# EAGLE schematic vr60 (EAGLE 9.5.1)

## Sheet 1 of 2
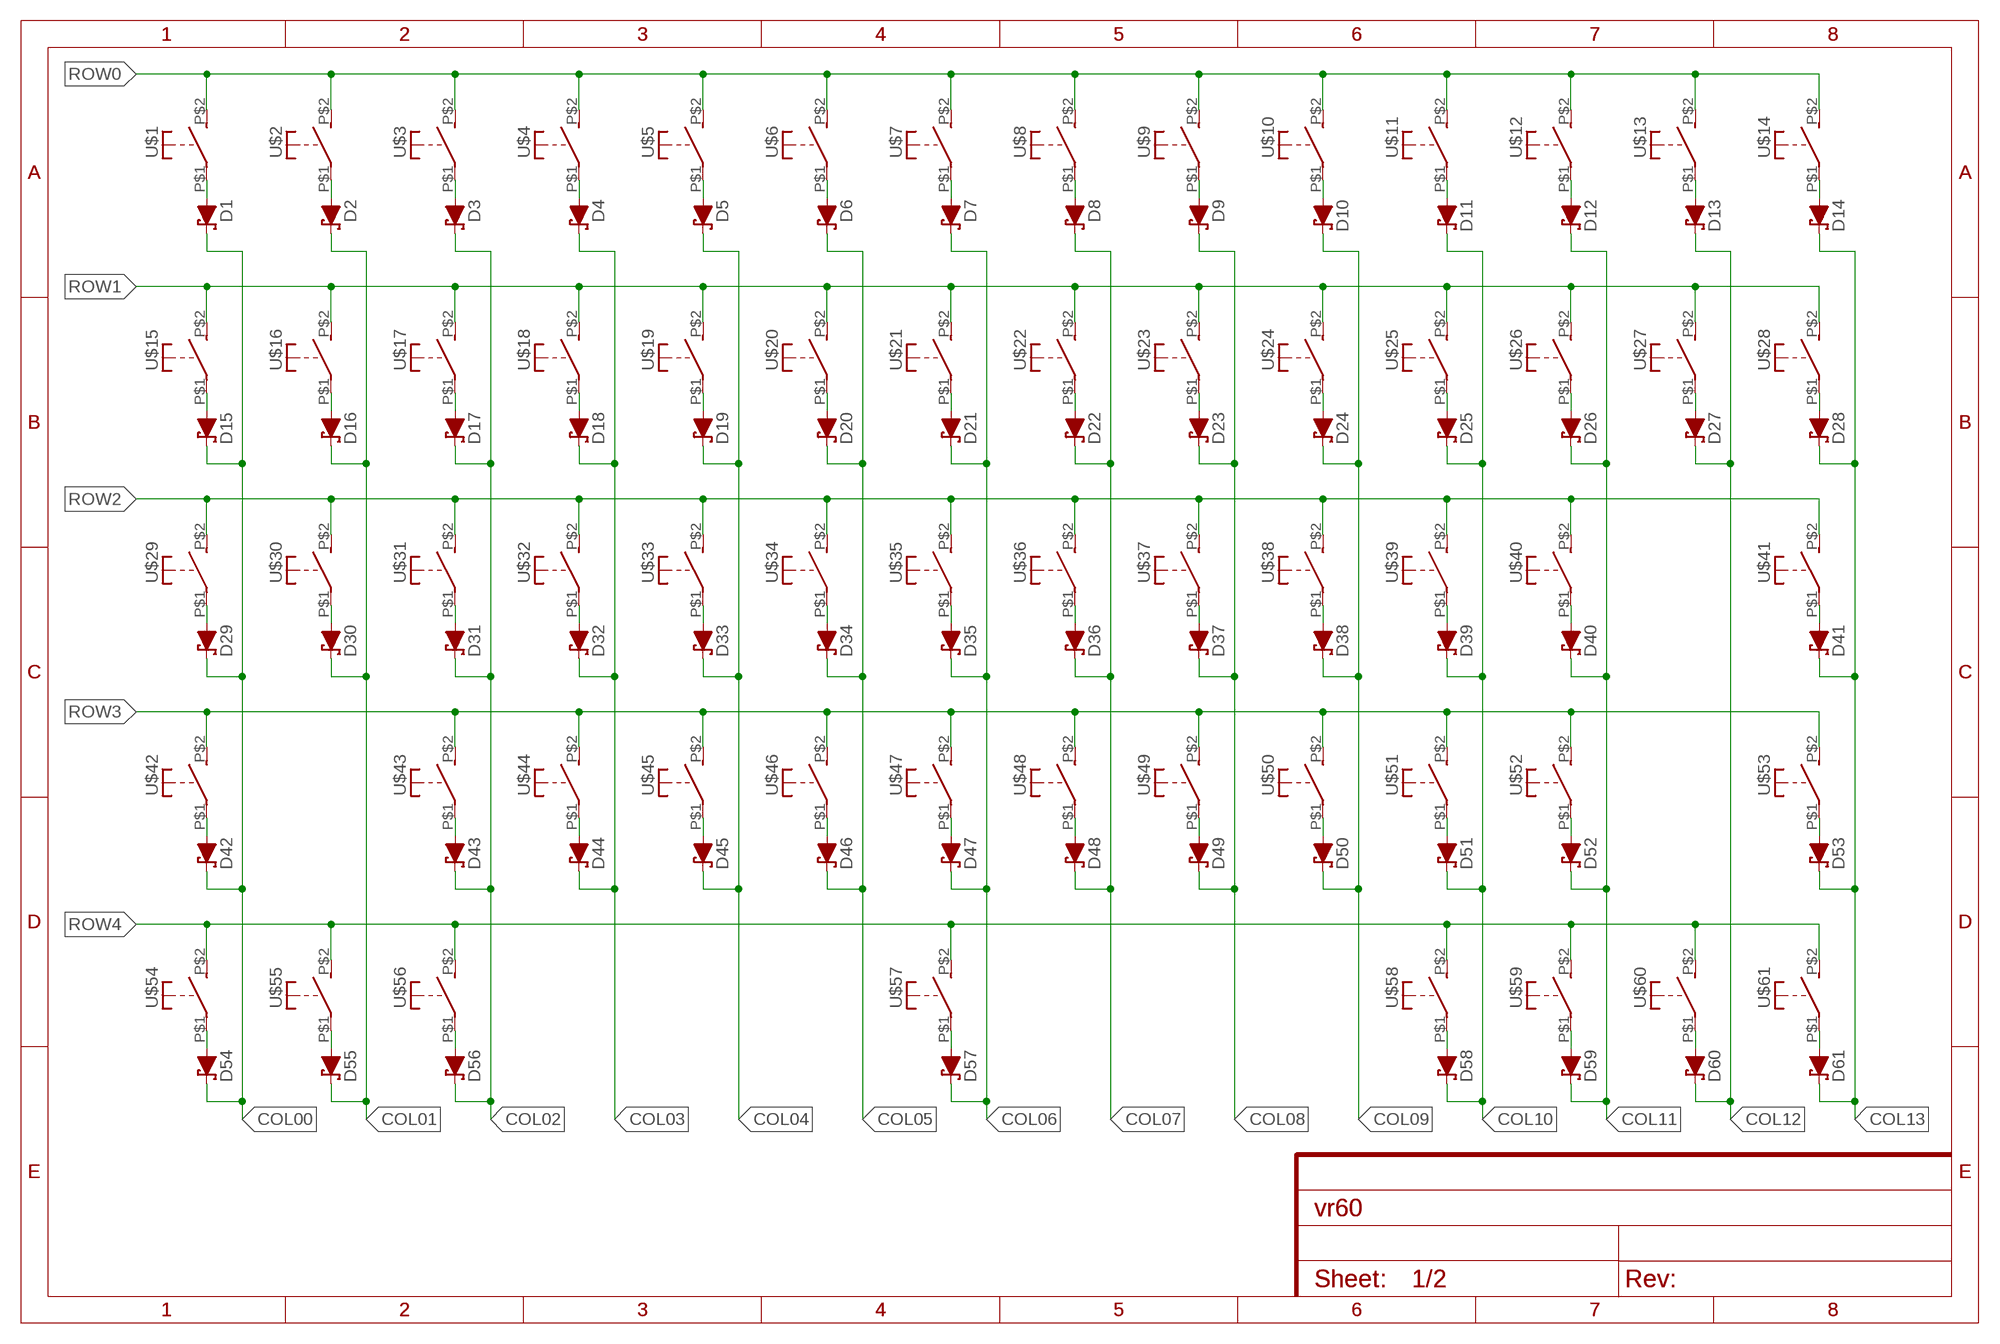
[diagram p0: schematic, sheet 1]

### Parts
D1  1N5819WS  [SOD-123]
D2  1N5819WS  [SOD-123]
D3  1N5819WS  [SOD-123]
D4  1N5819WS  [SOD-123]
D5  1N5819WS  [SOD-123]
D6  1N5819WS  [SOD-123]
D7  1N5819WS  [SOD-123]
D8  1N5819WS  [SOD-123]
D9  1N5819WS  [SOD-123]
D10  1N5819WS  [SOD-123]
D11  1N5819WS  [SOD-123]
D12  1N5819WS  [SOD-123]
D13  1N5819WS  [SOD-123]
D14  1N5819WS  [SOD-123]
D15  1N5819WS  [SOD-123]
D16  1N5819WS  [SOD-123]
D17  1N5819WS  [SOD-123]
D18  1N5819WS  [SOD-123]
D19  1N5819WS  [SOD-123]
D20  1N5819WS  [SOD-123]
D21  1N5819WS  [SOD-123]
D22  1N5819WS  [SOD-123]
D23  1N5819WS  [SOD-123]
D24  1N5819WS  [SOD-123]
D25  1N5819WS  [SOD-123]
D26  1N5819WS  [SOD-123]
D27  1N5819WS  [SOD-123]
D28  1N5819WS  [SOD-123]
D29  1N5819WS  [SOD-123]
D30  1N5819WS  [SOD-123]
D31  1N5819WS  [SOD-123]
D32  1N5819WS  [SOD-123]
D33  1N5819WS  [SOD-123]
D34  1N5819WS  [SOD-123]
D35  1N5819WS  [SOD-123]
D36  1N5819WS  [SOD-123]
D37  1N5819WS  [SOD-123]
D38  1N5819WS  [SOD-123]
D39  1N5819WS  [SOD-123]
D40  1N5819WS  [SOD-123]
D41  1N5819WS  [SOD-123]
D42  1N5819WS  [SOD-123]
D43  1N5819WS  [SOD-123]
D44  1N5819WS  [SOD-123]
D45  1N5819WS  [SOD-123]
D46  1N5819WS  [SOD-123]
D47  1N5819WS  [SOD-123]
D48  1N5819WS  [SOD-123]
D49  1N5819WS  [SOD-123]
D50  1N5819WS  [SOD-123]
D51  1N5819WS  [SOD-123]
D52  1N5819WS  [SOD-123]
D53  1N5819WS  [SOD-123]
D54  1N5819WS  [SOD-123]
D55  1N5819WS  [SOD-123]
D56  1N5819WS  [SOD-123]
D57  1N5819WS  [SOD-123]
D58  1N5819WS  [SOD-123]
D59  1N5819WS  [SOD-123]
D60  1N5819WS  [SOD-123]
D61  1N5819WS  [SOD-123]
U$1  MX-5-PIN-HOTSWAP  [MX-5-PIN-HOTSWAP]
U$2  MX-5-PIN-HOTSWAP  [MX-5-PIN-HOTSWAP]
U$3  MX-5-PIN-HOTSWAP  [MX-5-PIN-HOTSWAP]
U$4  MX-5-PIN-HOTSWAP  [MX-5-PIN-HOTSWAP]
U$5  MX-5-PIN-HOTSWAP  [MX-5-PIN-HOTSWAP]
U$6  MX-5-PIN-HOTSWAP  [MX-5-PIN-HOTSWAP]
U$7  MX-5-PIN-HOTSWAP  [MX-5-PIN-HOTSWAP]
U$8  MX-5-PIN-HOTSWAP  [MX-5-PIN-HOTSWAP]
U$9  MX-5-PIN-HOTSWAP  [MX-5-PIN-HOTSWAP]
U$10  MX-5-PIN-HOTSWAP  [MX-5-PIN-HOTSWAP]
U$11  MX-5-PIN-HOTSWAP  [MX-5-PIN-HOTSWAP]
U$12  MX-5-PIN-HOTSWAP  [MX-5-PIN-HOTSWAP]
U$13  MX-5-PIN-HOTSWAP  [MX-5-PIN-HOTSWAP]
U$14  MX-5-PIN-HOTSWAP  [MX-5-PIN-HOTSWAP]
U$15  MX-5-PIN-HOTSWAP  [MX-5-PIN-HOTSWAP]
U$16  MX-5-PIN-HOTSWAP  [MX-5-PIN-HOTSWAP]
U$17  MX-5-PIN-HOTSWAP  [MX-5-PIN-HOTSWAP]
U$18  MX-5-PIN-HOTSWAP  [MX-5-PIN-HOTSWAP]
U$19  MX-5-PIN-HOTSWAP  [MX-5-PIN-HOTSWAP]
U$20  MX-5-PIN-HOTSWAP  [MX-5-PIN-HOTSWAP]
U$21  MX-5-PIN-HOTSWAP  [MX-5-PIN-HOTSWAP]
U$22  MX-5-PIN-HOTSWAP  [MX-5-PIN-HOTSWAP]
U$23  MX-5-PIN-HOTSWAP  [MX-5-PIN-HOTSWAP]
U$24  MX-5-PIN-HOTSWAP  [MX-5-PIN-HOTSWAP]
U$25  MX-5-PIN-HOTSWAP  [MX-5-PIN-HOTSWAP]
U$26  MX-5-PIN-HOTSWAP  [MX-5-PIN-HOTSWAP]
U$27  MX-5-PIN-HOTSWAP  [MX-5-PIN-HOTSWAP]
U$28  MX-5-PIN-HOTSWAP  [MX-5-PIN-HOTSWAP]
U$29  MX-5-PIN-HOTSWAP  [MX-5-PIN-HOTSWAP]
U$30  MX-5-PIN-HOTSWAP  [MX-5-PIN-HOTSWAP]
U$31  MX-5-PIN-HOTSWAP  [MX-5-PIN-HOTSWAP]
U$32  MX-5-PIN-HOTSWAP  [MX-5-PIN-HOTSWAP]
U$33  MX-5-PIN-HOTSWAP  [MX-5-PIN-HOTSWAP]
U$34  MX-5-PIN-HOTSWAP  [MX-5-PIN-HOTSWAP]
U$35  MX-5-PIN-HOTSWAP  [MX-5-PIN-HOTSWAP]
U$36  MX-5-PIN-HOTSWAP  [MX-5-PIN-HOTSWAP]
U$37  MX-5-PIN-HOTSWAP  [MX-5-PIN-HOTSWAP]
U$38  MX-5-PIN-HOTSWAP  [MX-5-PIN-HOTSWAP]
U$39  MX-5-PIN-HOTSWAP  [MX-5-PIN-HOTSWAP]
U$40  MX-5-PIN-HOTSWAP  [MX-5-PIN-HOTSWAP]
U$41  MX-5-PIN-HOTSWAP  [MX-5-PIN-HOTSWAP]
U$42  MX-5-PIN-HOTSWAP  [MX-5-PIN-HOTSWAP]
U$43  MX-5-PIN-HOTSWAP  [MX-5-PIN-HOTSWAP]
U$44  MX-5-PIN-HOTSWAP  [MX-5-PIN-HOTSWAP]
U$45  MX-5-PIN-HOTSWAP  [MX-5-PIN-HOTSWAP]
U$46  MX-5-PIN-HOTSWAP  [MX-5-PIN-HOTSWAP]
U$47  MX-5-PIN-HOTSWAP  [MX-5-PIN-HOTSWAP]
U$48  MX-5-PIN-HOTSWAP  [MX-5-PIN-HOTSWAP]
U$49  MX-5-PIN-HOTSWAP  [MX-5-PIN-HOTSWAP]
U$50  MX-5-PIN-HOTSWAP  [MX-5-PIN-HOTSWAP]
U$51  MX-5-PIN-HOTSWAP  [MX-5-PIN-HOTSWAP]
U$52  MX-5-PIN-HOTSWAP  [MX-5-PIN-HOTSWAP]
U$53  MX-5-PIN-HOTSWAP  [MX-5-PIN-HOTSWAP]
U$54  MX-5-PIN-HOTSWAP  [MX-5-PIN-HOTSWAP]
U$55  MX-5-PIN-HOTSWAP  [MX-5-PIN-HOTSWAP]
U$56  MX-5-PIN-HOTSWAP  [MX-5-PIN-HOTSWAP]
U$57  MX-5-PIN-HOTSWAP  [MX-5-PIN-HOTSWAP]
U$58  MX-5-PIN-HOTSWAP  [MX-5-PIN-HOTSWAP]
U$59  MX-5-PIN-HOTSWAP  [MX-5-PIN-HOTSWAP]
U$60  MX-5-PIN-HOTSWAP  [MX-5-PIN-HOTSWAP]
U$61  MX-5-PIN-HOTSWAP  [MX-5-PIN-HOTSWAP]

### Nets
COL00: D1.C D15.C D29.C D42.C D54.C
COL01: D2.C D16.C D30.C D55.C
COL02: D3.C D17.C D31.C D43.C D56.C
COL03: D4.C D18.C D32.C D44.C
COL04: D5.C D19.C D33.C D45.C
COL05: D6.C D20.C D34.C D46.C
COL06: D7.C D21.C D35.C D47.C D57.C
COL07: D8.C D22.C D36.C D48.C
COL08: D9.C D23.C D37.C D49.C
COL09: D10.C D24.C D38.C D50.C
COL10: D11.C D25.C D39.C D51.C D58.C
COL11: D12.C D26.C D40.C D52.C D59.C
COL12: D13.C D27.C D60.C
COL13: D14.C D28.C D41.C D53.C D61.C
N$1: D1.A U$1.P$1(P)
N$2: D2.A U$2.P$1(P)
N$3: D3.A U$3.P$1(P)
N$4: D4.A U$4.P$1(P)
N$5: D5.A U$5.P$1(P)
N$6: D6.A U$6.P$1(P)
N$7: D7.A U$7.P$1(P)
N$8: D8.A U$8.P$1(P)
N$9: D9.A U$9.P$1(P)
N$10: D10.A U$10.P$1(P)
N$11: D11.A U$11.P$1(P)
N$12: D12.A U$12.P$1(P)
N$13: D13.A U$13.P$1(P)
N$14: D14.A U$14.P$1(P)
N$15: D15.A U$15.P$1(P)
N$16: D16.A U$16.P$1(P)
N$17: D17.A U$17.P$1(P)
N$18: D18.A U$18.P$1(P)
N$19: D19.A U$19.P$1(P)
N$20: D20.A U$20.P$1(P)
N$21: D21.A U$21.P$1(P)
N$22: D22.A U$22.P$1(P)
N$23: D23.A U$23.P$1(P)
N$24: D24.A U$24.P$1(P)
N$25: D25.A U$25.P$1(P)
N$26: D26.A U$26.P$1(P)
N$27: D27.A U$27.P$1(P)
N$28: D28.A U$28.P$1(P)
N$29: D29.A U$29.P$1(P)
N$30: D30.A U$30.P$1(P)
N$31: D31.A U$31.P$1(P)
N$32: D32.A U$32.P$1(P)
N$33: D33.A U$33.P$1(P)
N$34: D34.A U$34.P$1(P)
N$35: D35.A U$35.P$1(P)
N$36: D36.A U$36.P$1(P)
N$37: D37.A U$37.P$1(P)
N$38: D38.A U$38.P$1(P)
N$39: D39.A U$39.P$1(P)
N$40: D40.A U$40.P$1(P)
N$41: D41.A U$41.P$1(P)
N$42: D42.A U$42.P$1(P)
N$43: D43.A U$43.P$1(P)
N$44: D44.A U$44.P$1(P)
N$45: D45.A U$45.P$1(P)
N$46: D46.A U$46.P$1(P)
N$47: D47.A U$47.P$1(P)
N$48: D48.A U$48.P$1(P)
N$49: D49.A U$49.P$1(P)
N$50: D50.A U$50.P$1(P)
N$51: D51.A U$51.P$1(P)
N$52: D52.A U$52.P$1(P)
N$53: D53.A U$53.P$1(P)
N$54: D54.A U$54.P$1(P)
N$55: D55.A U$55.P$1(P)
N$56: D56.A U$56.P$1(P)
N$57: D57.A U$57.P$1(P)
N$58: D58.A U$58.P$1(P)
N$59: D59.A U$59.P$1(P)
N$60: D60.A U$60.P$1(P)
N$61: D61.A U$61.P$1(P)
ROW0: U$1.P$2(S) U$2.P$2(S) U$3.P$2(S) U$4.P$2(S) U$5.P$2(S) U$6.P$2(S) U$7.P$2(S) U$8.P$2(S) U$9.P$2(S) U$10.P$2(S) U$11.P$2(S) U$12.P$2(S) U$13.P$2(S) U$14.P$2(S)
ROW1: U$15.P$2(S) U$16.P$2(S) U$17.P$2(S) U$18.P$2(S) U$19.P$2(S) U$20.P$2(S) U$21.P$2(S) U$22.P$2(S) U$23.P$2(S) U$24.P$2(S) U$25.P$2(S) U$26.P$2(S) U$27.P$2(S) U$28.P$2(S)
ROW2: U$29.P$2(S) U$30.P$2(S) U$31.P$2(S) U$32.P$2(S) U$33.P$2(S) U$34.P$2(S) U$35.P$2(S) U$36.P$2(S) U$37.P$2(S) U$38.P$2(S) U$39.P$2(S) U$40.P$2(S) U$41.P$2(S)
ROW3: U$42.P$2(S) U$43.P$2(S) U$44.P$2(S) U$45.P$2(S) U$46.P$2(S) U$47.P$2(S) U$48.P$2(S) U$49.P$2(S) U$50.P$2(S) U$51.P$2(S) U$52.P$2(S) U$53.P$2(S)
ROW4: U$54.P$2(S) U$55.P$2(S) U$56.P$2(S) U$57.P$2(S) U$58.P$2(S) U$59.P$2(S) U$60.P$2(S) U$61.P$2(S)

## Sheet 2 of 2
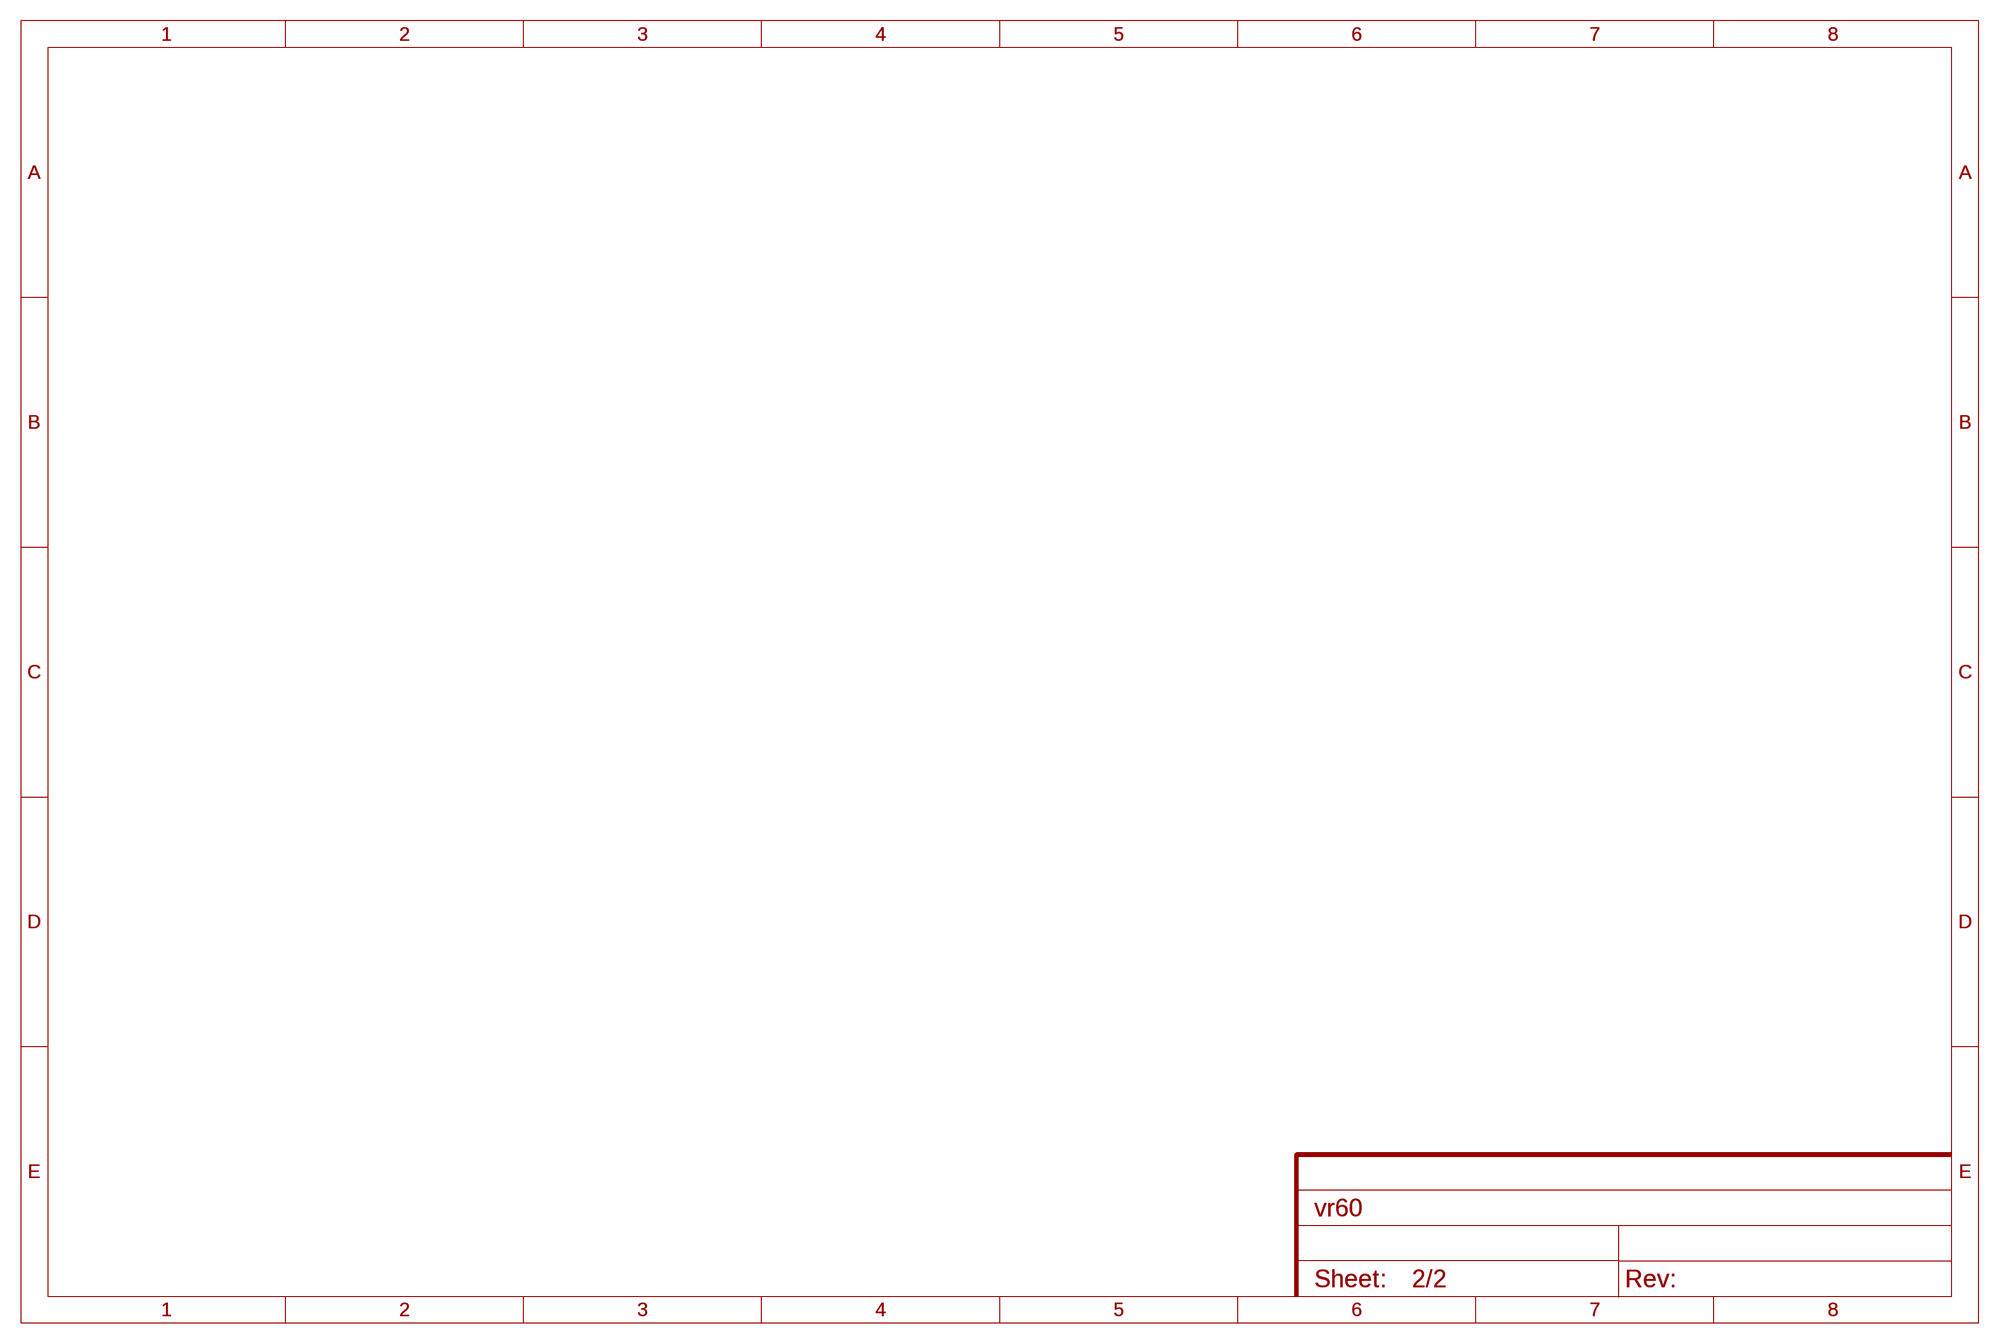
[diagram p1: schematic, sheet 2]

## Library data of the parts
D1-D61 = jlcpcb_basic_parts:1N5819WS: JLCPCB Part # C8598 Description 40V 600mV@1A 1A SOD-123 Schottky Barrier Diodes (SBD) ROHS Schottky Diode
U$1-U$61 = ts_keyboards:MX-5-PIN-HOTSWAP